# EAGLE schematic vfobox (EAGLE 7.2.0)
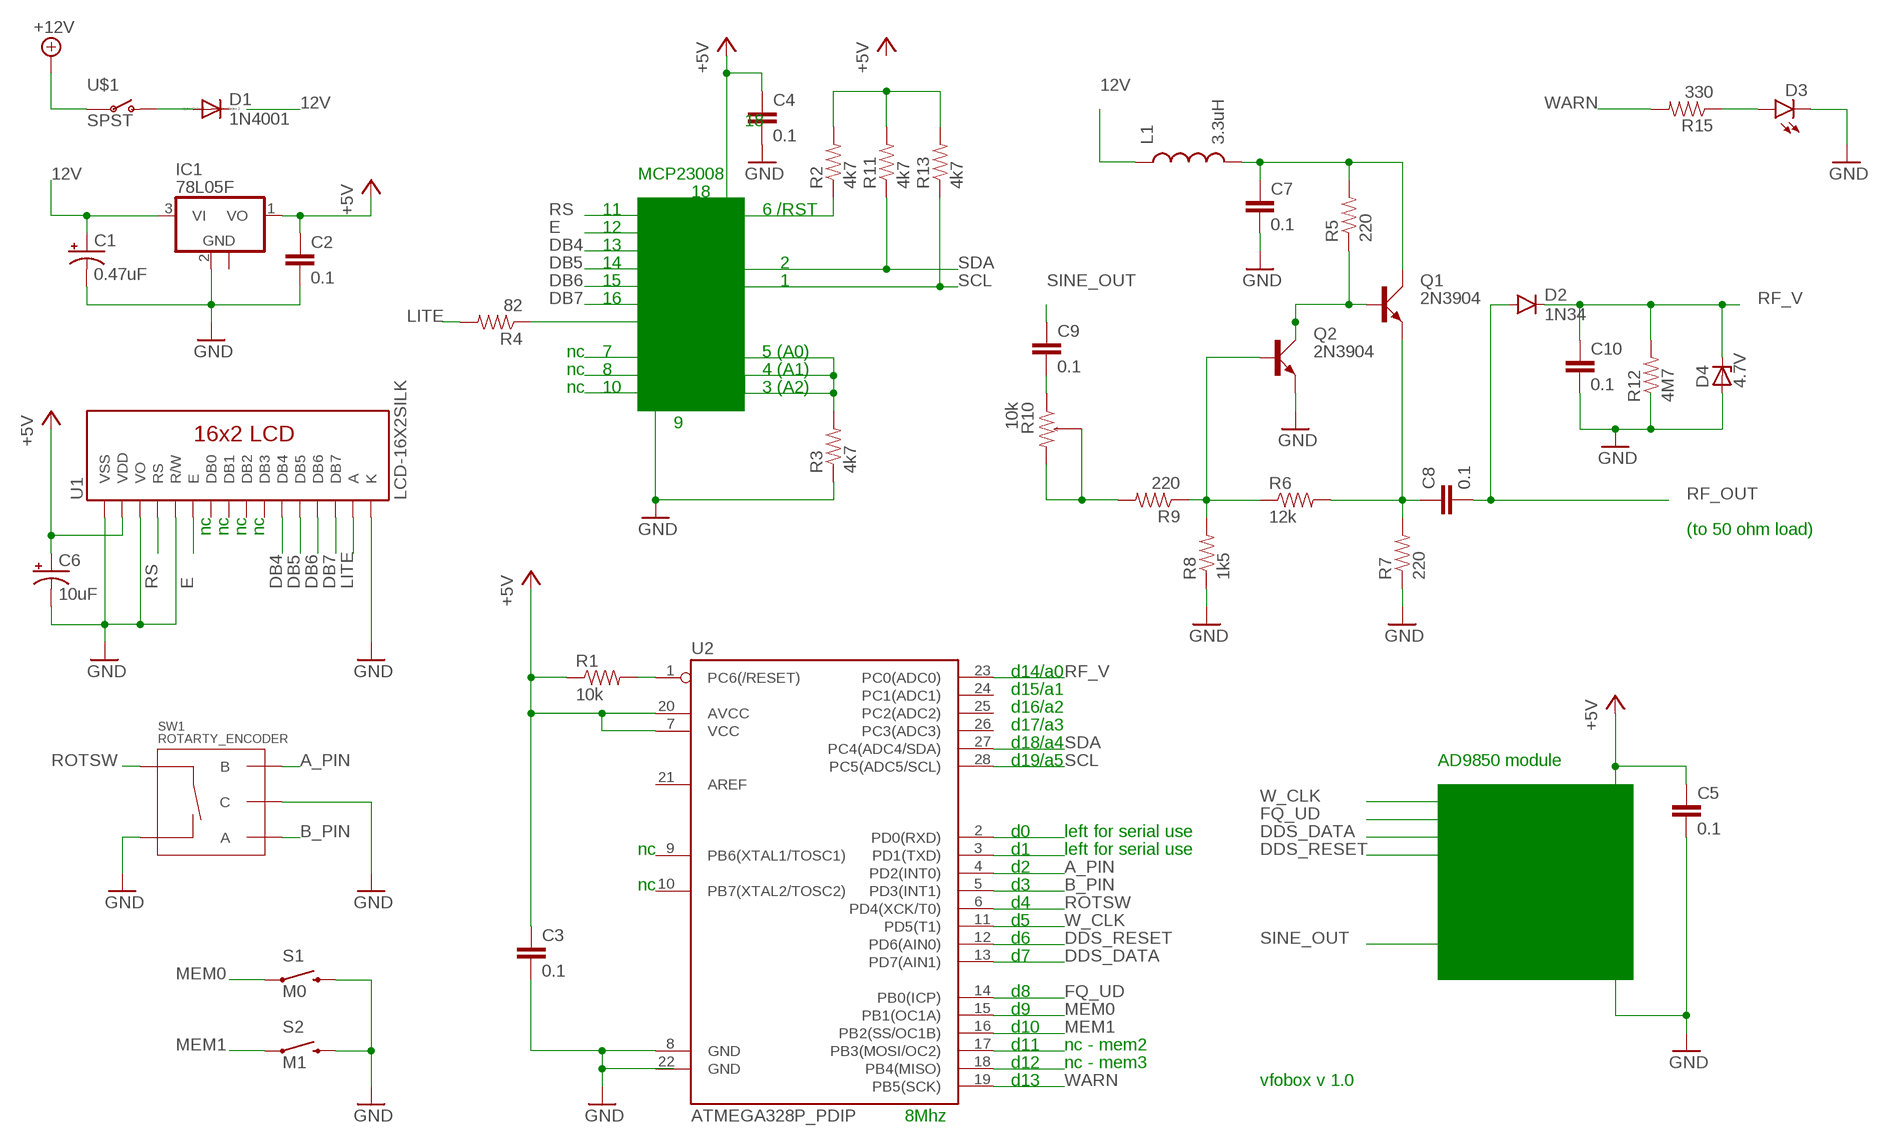
[diagram p0: schematic, sheet 1]

## Parts
C1  0.47uF  CAP_POL1206  [EIA3216]
C2  0.1  0.1UF-50V-20%(PTH)KIT-EZ  [CAP-PTH-SMALL-KIT]
C3  0.1  0.1UF-50V-20%(PTH)KIT-EZ  [CAP-PTH-SMALL-KIT]
C4  0.1  0.1UF-50V-20%(PTH)KIT-EZ  [CAP-PTH-SMALL-KIT]
C5  0.1  0.1UF-50V-20%(PTH)KIT-EZ  [CAP-PTH-SMALL-KIT]
C6  10uF  CAP_POL1206  [EIA3216]
C7  0.1  0.1UF-50V-20%(PTH)KIT-EZ  [CAP-PTH-SMALL-KIT]
C8  0.1  0.1UF-50V-20%(PTH)KIT-EZ  [CAP-PTH-SMALL-KIT]
C9  0.1  0.1UF-50V-20%(PTH)KIT-EZ  [CAP-PTH-SMALL-KIT]
C10  0.1  0.1UF-50V-20%(PTH)KIT-EZ  [CAP-PTH-SMALL-KIT]
D1  1N4001  1N4004  [DO41-10]
D2  1N34  DIODE1N4148  [DIODE-1N4148]
D3  LED5MM  [LED5MM]
D4  4.7V  ZENER-DIODEDO35Z10  [DO35Z10]
IC1  78L05F  [SOT89]
L1  3.3uH  INDUCTOR  [INDUCTOR-SRP4020]
Q1  2N3904  [TO92D]
Q2  2N3904  [TO92D]
R1  10k  RESISTORKIT  [AXIAL-0.3-KIT]
R2  4k7  RESISTORKIT  [AXIAL-0.3-KIT]
R3  4k7  RESISTORKIT  [AXIAL-0.3-KIT]
R4  82  RESISTORKIT  [AXIAL-0.3-KIT]
R5  220  RESISTORKIT  [AXIAL-0.3-KIT]
R6  12k  RESISTORKIT  [AXIAL-0.3-KIT]
R7  220  RESISTORKIT  [AXIAL-0.3-KIT]
R8  1k5  RESISTORKIT  [AXIAL-0.3-KIT]
R9  220  RESISTORKIT  [AXIAL-0.3-KIT]
R10  10k  POTENTIOMETER  [0603-ARV]
R11  4k7  RESISTORKIT  [AXIAL-0.3-KIT]
R12  4M7  RESISTORKIT  [AXIAL-0.3-KIT]
R13  4k7  RESISTORKIT  [AXIAL-0.3-KIT]
R15  330  RESISTORKIT  [AXIAL-0.3-KIT]
S1  M0  SWITCH-MOMENTARY-2PTH  [TACTILE-PTH]
S2  M1  SWITCH-MOMENTARY-2PTH  [TACTILE-PTH]
SW1  ROTARTY_ENCODER  [ROTARY_ENC_PLAIN]
U1  LCD-16X2SILK  [LCD-16X2]
U2  ATMEGA328P_PDIP  [DIL28-3]
U$1  SPST  SWITCH-SPST-2RA  [R_SW_TH]

## Nets
12V: C1.A(+) IC1.3(VI)
+5V: C2.1 C3.1 C4.1 C5.1 C6.A(+) IC1.1(VO) R1.P$1 U1.2(VDD) U2.7(VCC) U2.20(AVCC)
+12V: U$1.P$4(P)
A_PIN: SW1.B U2.4(PD2(INT0))
B_PIN: SW1.A U2.5(PD3(INT1))
DB4: U1.11(DB4)
DB5: U1.12(DB5)
DB6: U1.13(DB6)
DB7: U1.14(DB7)
DDS_DATA: U2.13(PD7(AIN1))
DDS_RESET: U2.12(PD6(AIN0))
E: U1.6(E)
FQ_UD: U2.14(PB0(ICP))
GND: C1.C(-) C2.2 C3.2 C4.2 C5.2 C6.C(-) C7.2 C10.2 D3.K(C) D4.A IC1.2(GND) Q2.E R3.P$1 R7.P$1 R8.P$1 S1.3 S2.3 SW1.C SW1.SW- U1.1(VSS) U1.3(VO) U1.5(R/W) U1.16(K) U2.8(GND)
LITE: R4.P$2 U1.15(A)
MEM0: S1.1 U2.15(PB1(OC1A))
MEM1: S2.1 U2.16(PB2(SS/OC1B))
MEM2: U2.18(PB4(MISO))
N$1: R3.P$2
N$2: R1.P$2 U2.1(PC6(/RESET))
N$6: R9.P$2 R10.2 R10.3 R10.4 R10.5 R10.6 R10.7 R10.8
N$7: C7.1 L1.P$2 Q1.C R5.P$2
N$8: R4.P$1
N$9: Q1.B Q2.C R5.P$1
N$10: Q2.B R6.P$1 R8.P$2 R9.P$1
N$11: C8.1 Q1.E R6.P$2 R7.P$2
N$12: C9.2 R10.1
N$13: D1.A U$1.P$3(O)
N$14: L1.P$1
N$15: U2.2(PD0(RXD))
N$16: U2.3(PD1(TXD))
N$17: U2.17(PB3(MOSI/OC2))
N$18: D3.A R15.P$1
N$19: R2.P$2 R11.P$2 R13.P$2
RESET: R2.P$1
RF_OUT: C8.2 D2.A
RF_V: C10.1 D2.C D4.C R12.P$2 U2.23(PC0(ADC0))
ROTSW: SW1.SW+ U2.6(PD4(XCK/T0))
RS: U1.4(RS)
SCL: R13.P$1 U2.28(PC5(ADC5/SCL))
SDA: R11.P$1 U2.27(PC4(ADC4/SDA))
SINE_OUT: C9.1
W_CLK: U2.11(PD5(T1))
WARN: R15.P$2 U2.19(PB5(SCK))
Unconnected: D1.C IC1.2@1(GND) R12.P$1 U1.7(DB0) U1.8(DB1) U1.9(DB2) U1.10(DB3) U2.9(PB6(XTAL1/TOSC1)) U2.10(PB7(XTAL2/TOSC2)) U2.21(AREF) U2.22(GND) U2.24(PC1(ADC1)) U2.25(PC2(ADC2)) U2.26(PC3(ADC3))

## Notes on the sheet
- 18
- MCP23008
- 18
- 11 | 6 /RST
- 12
- 13
- 14 | 2
- 15 | 1
- 16
- nc | 7 | 5 (A0)
- nc | 8 | 4 (A1)
- nc | 10 | 3 (A2)
- 9
- nc | nc | nc | nc | (to 50 ohm load)
- d14/a0
- d15/a1
- d16/a2
- d17/a3
- d18/a4
- d19/a5 | AD9850 module
- d0 | left for serial use
- nc | d1 | left for serial use
- d2
- nc | d3
- d4
- d5
- d6
- d7
- d8
- d9
- d10
- d11 | nc - mem2
- d12 | nc - mem3
- d13 | vfobox v 1.0
- 8Mhz

## Library data of the parts
C1 C6 = SparkFun-Capacitors:CAP_POL: Capacitor Polarized These are standard SMD and PTH capacitors. Normally 10uF, 47uF, and 100uF in electrolytic and tantalum varieties. Always verify the external diameter of the through hole cap, it varies with capacity, voltage, and manufacturer. The EIA devices should be standard.
C2-C5 C7-C10 = SparkFun-Capacitors:0.1UF-50V-20%(PTH): CAP-08370; PROD_ID: CAP-08370
D1 = diode:1N4004: DIODE general purpose rectifier, 1 A
D2 = SparkFun-DiscreteSemi:DIODE: Diode These are standard reverse protection diodes and small signal diodes. SMA package can handle up to about 1A. SOD-323 can handle about 200mA. What the SOD-323 package when ordering, there are some mfgs out there that are 5-pin packages.
D3 = SparkFun-LED:LED: LEDs Standard schematic elements and footprints for 5mm, 3mm, 1206, and 0603 sized LEDs. 5mm - Spark Fun Electronics SKU : COM-00529 (and others)
D4 = diode:ZENER-DIODE: Z-Diode
IC1 = linear:78L*: POSITOIV-VOLTAGE REGULATORS Output up to 100 mA Source: Datasheet <http://focus.ti.com/lit/ds/symlink/ua78l05.pdf>
L1 = SparkFun-Passives:INDUCTOR: Inductors Basic Inductor/Choke - 0603 and 1206. Footprints are not proven and vary greatly between part numbers. INDUCTOR POWER 3.3UH 4.0A SMD 0.197" L x 0.197" W x 0.177" H (5.00mm x 5.00mm x 4.50mm)
Q1 Q2 = transistor-small-signal:2N3904: NPN TRANSISTOR
R1-R9 R11-R13 R15 = SparkFun-Passives:RESISTOR: Resistor Basic schematic elements and footprints for 0603, 1206, and PTH resistors.
R10 = SparkFun-Passives:POTENTIOMETER
S1 S2 = SparkFun-Electromechanical:SWITCH-MOMENTARY-2: Various NO switches- pushbuttons, reed, etc; PROD_ID: SWCH-08441
SW1 = SparkFun-Electromechanical:ROTARTY_ENCODER: Simple no LED rotary encoder Example: COM-09117
U1 = SparkFun-Displays:LCD-16X2: Standard text-only 16x2 parallel input LCD
U2 = SparkFun-DigitalIC:ATMEGA328P_PDIP: uC used in the Arduino 32kb flash, 1k EEPROM, 2k SRAM This is the through-hole version of this chip.
U$1 = SparkFun-Electromechanical:SWITCH-SPST-2